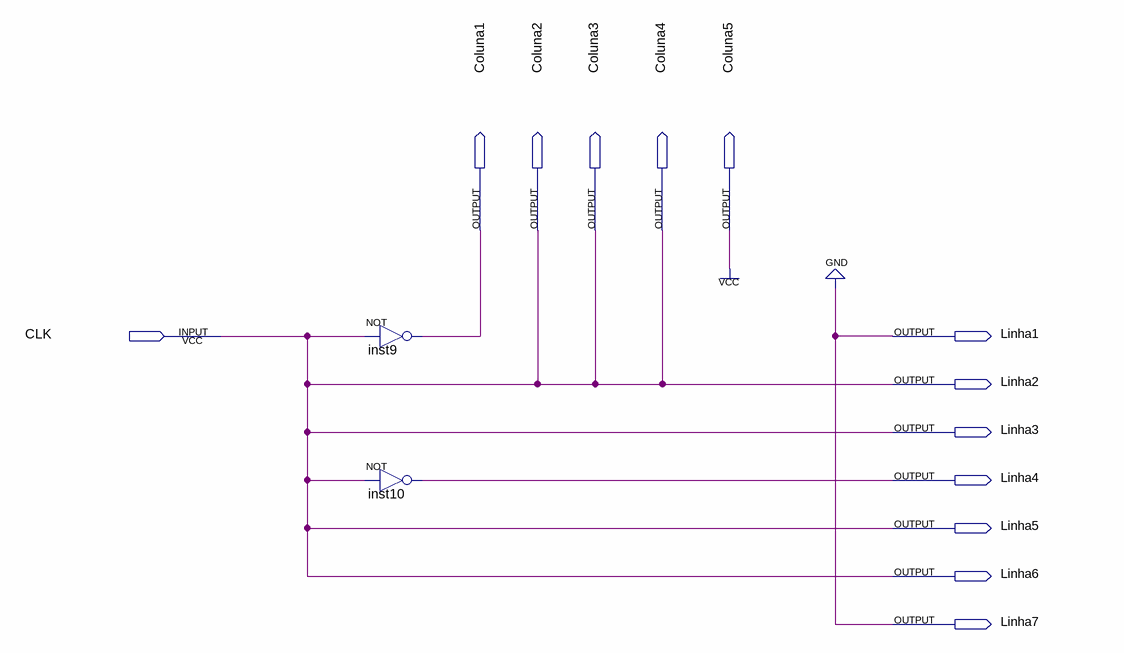
[diagram p0: schematic sheet]
// Quartus schematic LetraB.bdf as structural Verilog: 2 symbols, 13 pins
module LetraB (
  input  CLK,
  output Coluna1,
  output Coluna2,
  output Coluna3,
  output Coluna4,
  output Coluna5,
  output Linha1,
  output Linha2,
  output Linha3,
  output Linha4,
  output Linha5,
  output Linha6,
  output Linha7
);

  not inst9 (Coluna1, CLK);
  not inst10 (Linha4, CLK);

  assign Coluna2 = CLK;
  assign Coluna3 = CLK;
  assign Coluna4 = CLK;
  assign Coluna5 = 1'b1;
  assign Linha1 = 1'b0;
  assign Linha2 = CLK;
  assign Linha3 = CLK;
  assign Linha5 = CLK;
  assign Linha6 = CLK;
  assign Linha7 = 1'b0;
endmodule
